# Altium schematic sheet HT7463A.SchDoc
size A
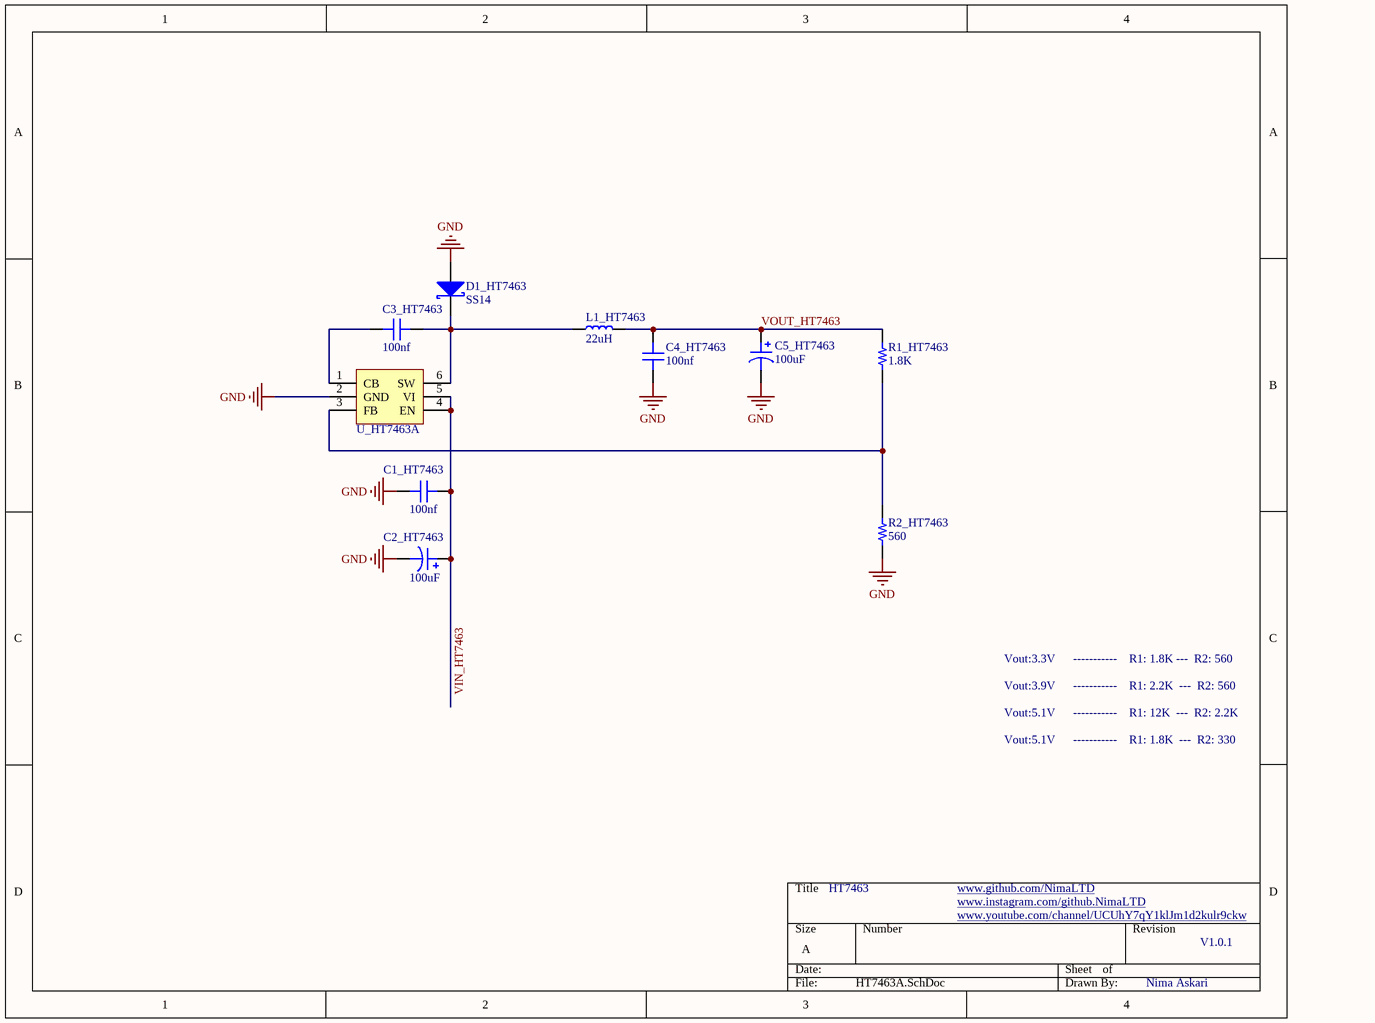
[diagram p0: HT7463A.SchDoc]

## Parts
C1_HT7463  100nf  [CAP 1206]
C2_HT7463  100uF  [CAP AL SMD D6 H6]
C3_HT7463  100nf  [CAP 0805]
C4_HT7463  100nf  [CAP 0805]
C5_HT7463  100uF  [CAP AL SMD D6 H6]
D1_HT7463  Parameter 1: SS14  [DO214AC SMA]  (hidden comment: SS14 SMD)
L1_HT7463  value 22uH  [IND 5X5]  (hidden comment: Inductor SMD POWER 5X5mm)
R1_HT7463  1.8K  [RES 0805]
R2_HT7463  560  [RES 0805]
U_HT7463A  HT7463  [SOT23-6]  (value not drawn)

## Nets
GND: C1_HT7463.1 C2_HT7463.2 C4_HT7463.1 C5_HT7463.2 D1_HT7463.1(A) R2_HT7463.1 U_HT7463A.2(GND)
VIN_HT7463: C1_HT7463.2 C2_HT7463.1 U_HT7463A.4(EN) U_HT7463A.5(VI)
VOUT_HT7463: C4_HT7463.2 C5_HT7463.1 L1_HT7463.2 R1_HT7463.2
NetC3_HT7463_1: C3_HT7463.1 U_HT7463A.1(CB)
NetC3_HT7463_2: C3_HT7463.2 D1_HT7463.2(K) L1_HT7463.1 U_HT7463A.6(SW)
NetR1_HT7463_1: R1_HT7463.1 R2_HT7463.2 U_HT7463A.3(FB)

## Notes on the sheet
- Vout:3.3V      -----------    R1: 1.8K ---  R2: 560
- Vout:3.9V      -----------    R1: 2.2K  ---  R2: 560
- Vout:5.1V      -----------    R1: 12K  ---  R2: 2.2K
- Vout:5.1V      -----------    R1: 1.8K  ---  R2: 330
- HT7463
- www.github.com/NimaLTD <http://www.github.com/NimaLTD>
- www.instagram.com/github.NimaLTD <http://www.instagram.com/github.NimaLTD>
- www.youtube.com/channel/UCUhY7qY1klJm1d2kulr9ckw <http://www.youtube.com/channel/UCUhY7qY1klJm1d2kulr9ckw>
- V1.0.1
- Nima Askari

## Library data of the parts
C1_HT7463 = Cap SMD 1206: SMT Capacitor; Value: 100nf
C2_HT7463 C5_HT7463 = Pol Cap SMD AL D6 H6: SMT Polarised Capacitor; Value: 100uF
C3_HT7463 C4_HT7463 = Cap SMD 0805: SMT Capacitor; Value: 100nf
D1_HT7463 = SS14 SMD: 1A Schottky
L1_HT7463 = Inductor SMD POWER 5X5mm: SMT Inductor
R1_HT7463 R2_HT7463 = Res SMD 0805: SMD Resistor
  R1_HT7463: Value: 1.8K
  R2_HT7463: Value: 560